# Altium project PCB_Project.PrjPcb
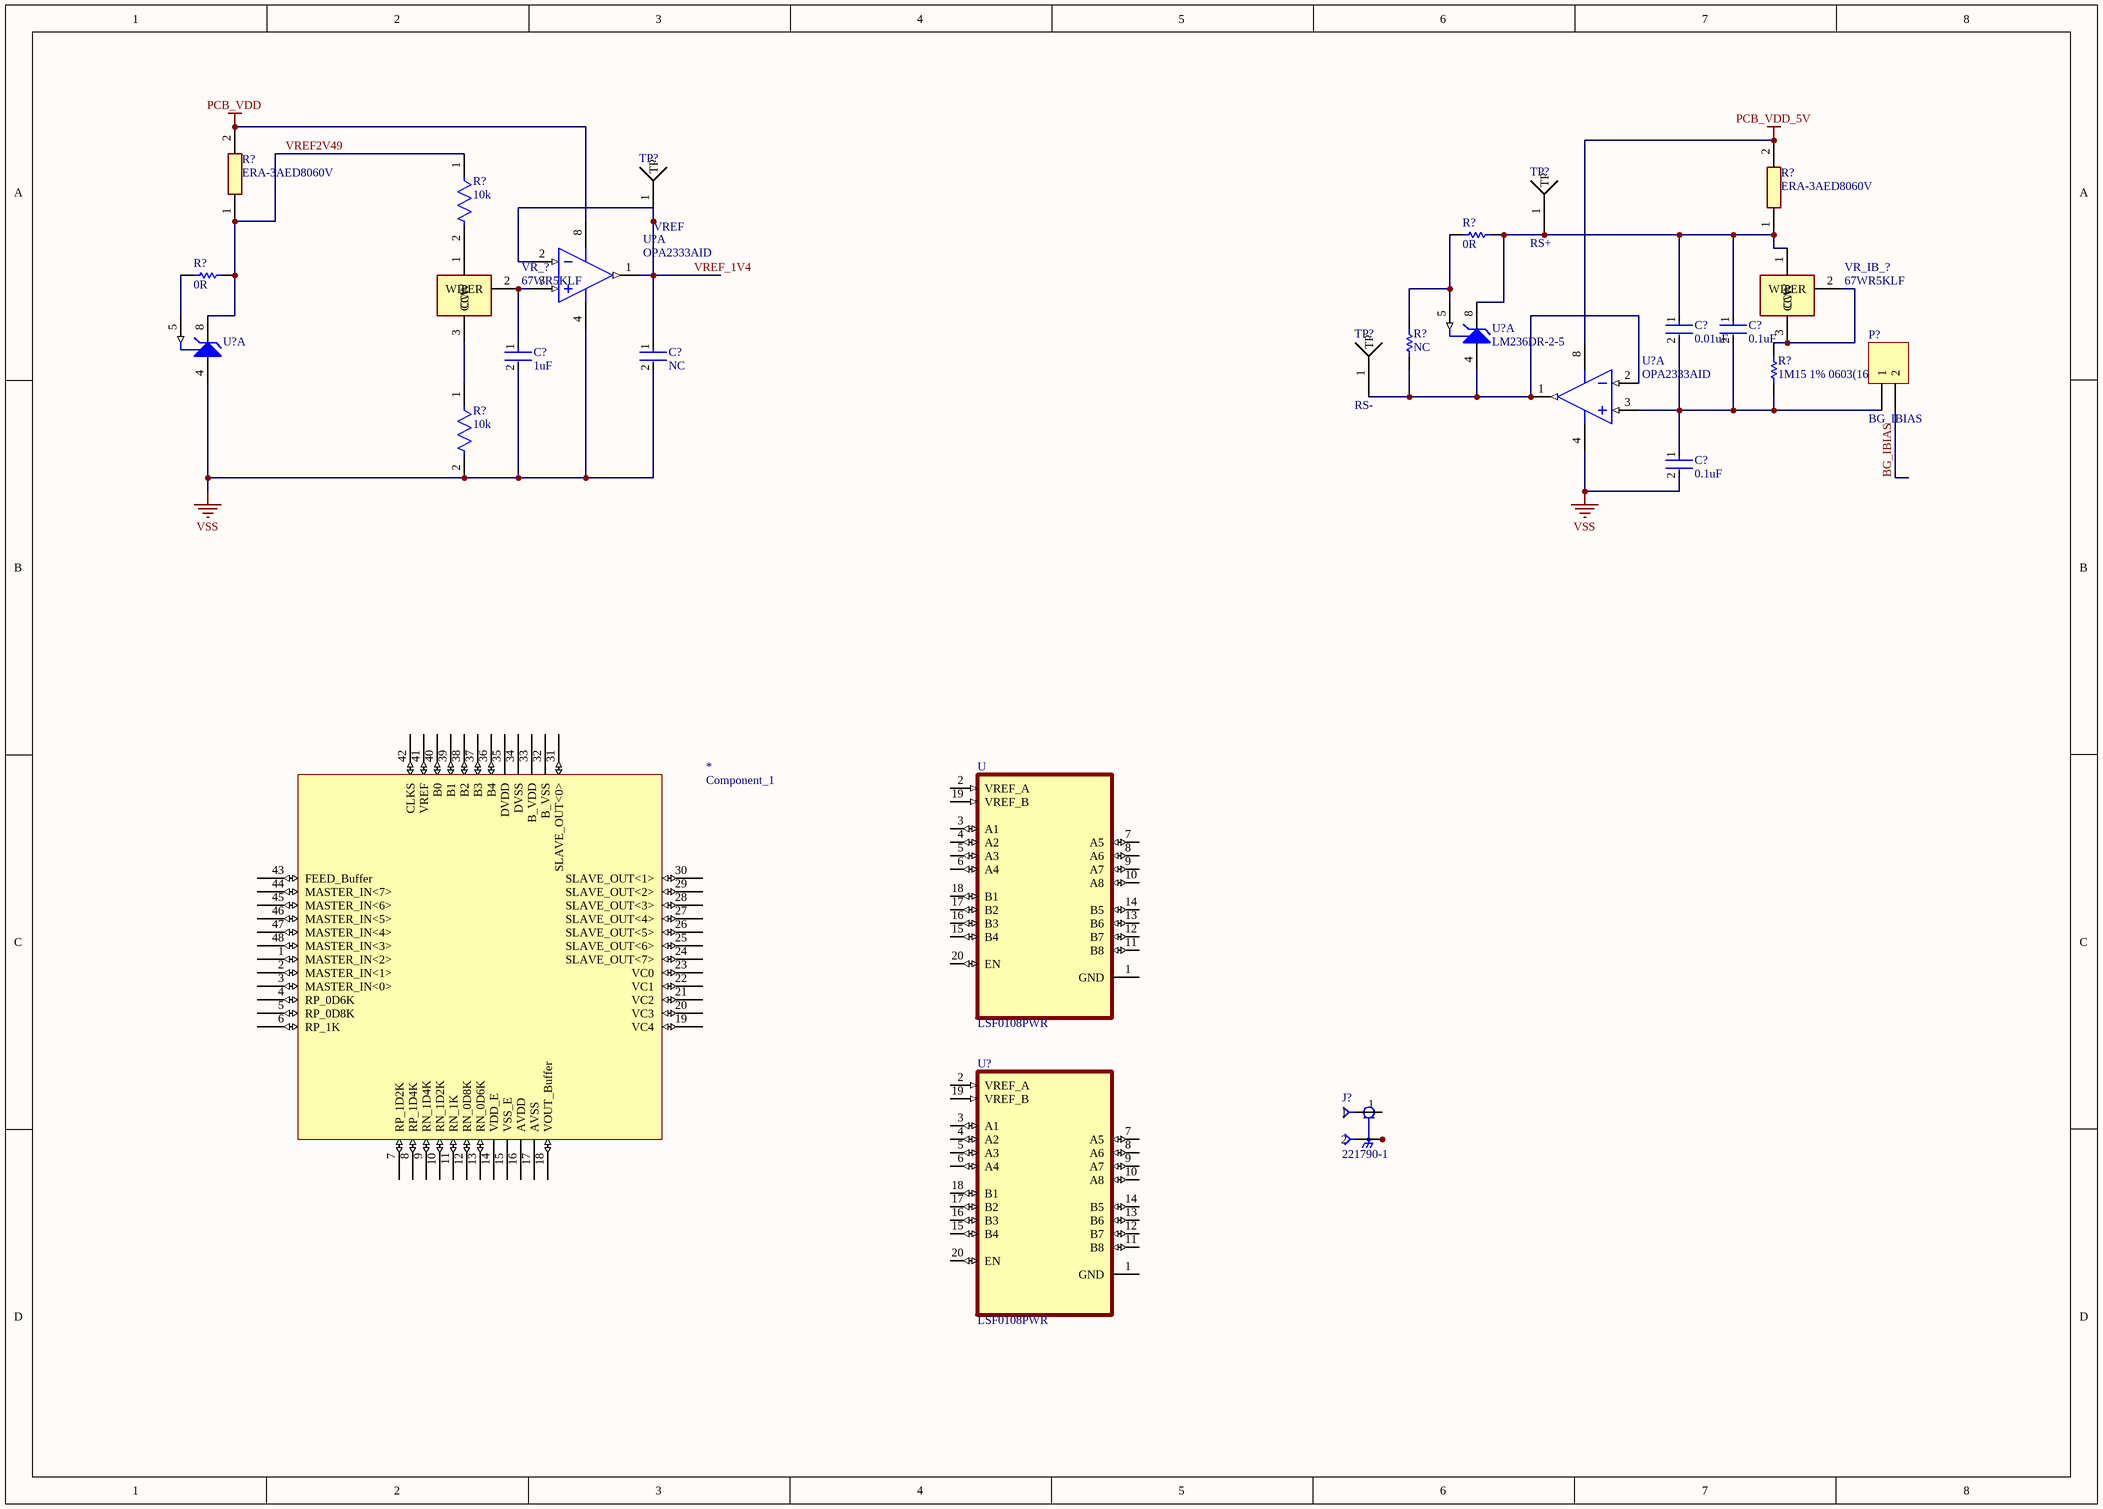
[diagram p0: ADPLL.SchDoc]
1 sheet, 27 parts. Net scope: global (net labels, ports and power ports of the same name join across sheets).

## Sheet ADPLL.SchDoc
size A3; SheetNumber: 1; SheetTotal: 2

### Parts
(Parts that share a designator on the sheet are numbered #1, #2 ... from top to bottom, then left to right.)
*  Component_1  [SB48(DIP48)]
C?#1  0.01uF  [FP-CC0603-DA-MFG]
C?#2  0.1uF  [FP-CC0603-DA-MFG]
C?#3  1uF  [FP-CC0603-DA-MFG]
C?#4  NC  [FP-CC0603-DA-MFG]
C?#5  0.1uF  [FP-CC0603-DA-MFG]
J?  221790-1  [TE_221790-1]
P?  BG_IBIAS  [HDR1X2]
R?#1  10k  [FP-RC0603-0_55-MFG]
R?#2  ERA-3AED8060V  [ERA3AEB101V]
R?#3  0R  [RESC1608X55X25ML10T15]
R?#4  ERA-3AED8060V  [ERA3AEB101V]
R?#5  0R  [RESC1608X55X25ML10T15]
R?#6  NC  [RESC1608X55X25ML10T15]
R?#7  10k  [FP-RC0603-0_55-MFG]
R?#8  1M15 1% 0603(1608)  [RESC0603(1608)_N]
TP?#1  VREF  [TEST_POINT]
TP?#2  RS+  [TEST_POINT]
TP?#3  RS-  [TEST_POINT]
U  LSF0108PWR  [SOP65P640X120-20N]
U?#1  OPA2333AID  [D0008A_L]  (part A of 2)
U?#2  LM236DR-2-5  [D0008A_M]  (part A of 2)
U?#3  (no value)  [D0008A_M]  (part A of 2)
U?#4  OPA2333AID  [D0008A_L]  (part A of 2)
U?#5  LSF0108PWR  [SOP65P640X120-20N]
VR_?  67WR5KLF  [67WR5KLF]
VR_IB_?  67WR5KLF  [67WR5KLF]

### Nets
PCB_VDD: R?#2.2 U?#1.8(V+)
PCB_VDD_5V: R?#4.2 U?#4.8(V+)
VSS: C?#3.2 C?#4.2 C?#5.2 R?#7.2 U?#1.4(V-) U?#3.4(ANODE) U?#4.4(V-)
BG_IBIAS: P?.2
VREF2V49: R?#1.1 R?#2.1 R?#5.2 U?#3.8(CATHODE)
VREF_1V4: C?#4.1 TP?#1.1(TP) U?#1.1(OUT_A) U?#1.2(IN_A-)
NetC?#1_1: C?#1.1 C?#2.1 R?#3.1 R?#4.1 TP?#2.1(TP) U?#2.8(CATHODE) VR_IB_?.1(CCW)
NetC?#1_2: C?#1.2 C?#2.2 C?#5.1 P?.1 R?#8.1 U?#4.3(IN_A+)
NetC?#3_1: C?#3.1 U?#1.3(IN_A+) VR_?.2(WIPER)
NetJ?_2: J?.2 J?.3 J?.4 J?.5
NetR?#1_2: R?#1.2 VR_?.1(CCW)
NetR?#3_2: R?#3.2 R?#6.1 U?#2.5(ADJ)
NetR?#5_1: R?#5.1 U?#3.5(ADJ)
NetR?#6_2: R?#6.2 TP?#3.1(TP) U?#2.4(ANODE) U?#4.1(OUT_A) U?#4.2(IN_A-)
NetR?#7_1: R?#7.1 VR_?.3(CW)
NetR?#8_2: R?#8.2 VR_IB_?.2(WIPER) VR_IB_?.3(CW)

Not connected (* = marked no-connect by the designer): * 1(MASTER_IN<2>) 2(MASTER_IN<1>) 3(MASTER_IN<0>) 4(RP_0D6K) 5(RP_0D8K) 6(RP_1K) 7(RP_1D2K) 8(RP_1D4K) 9(RN_1D4K) 10(RN_1D2K) 11(RN_1K) 12(RN_0D8K) 13(RN_0D6K) 14(VDD_E) 15(VSS_E) 16(AVDD) 17(AVSS) 18(VOUT_Buffer) 19(VC4) 20(VC3) 21(VC2) 22(VC1) 23(VC0) 24(SLAVE_OUT<7>) 25(SLAVE_OUT<6>) 26(SLAVE_OUT<5>) 27(SLAVE_OUT<4>) 28(SLAVE_OUT<3>) 29(SLAVE_OUT<2>) 30(SLAVE_OUT<1>) 31(SLAVE_OUT<0>) 32(B_VSS) 33(B_VDD) 34(DVSS) 35(DVDD) 36(B4) 37(B3) 38(B2) 39(B1) 40(B0) 41(VREF) 42(CLKS) 43(FEED_Buffer) 44(MASTER_IN<7>) 45(MASTER_IN<6>) 46(MASTER_IN<5>) 47(MASTER_IN<4>) 48(MASTER_IN<3>); J? 1; U 1(GND) 2(VREF_A) 3(A1) 4(A2) 5(A3) 6(A4) 7(A5) 8(A6) 9(A7) 10(A8) 11(B8) 12(B7) 13(B6) 14(B5) 15(B4) 16(B3) 17(B2) 18(B1) 19(VREF_B) 20(EN); U?#5 1(GND) 2(VREF_A) 3(A1) 4(A2) 5(A3) 6(A4) 7(A5) 8(A6) 9(A7) 10(A8) 11(B8) 12(B7) 13(B6) 14(B5) 15(B4) 16(B3) 17(B2) 18(B1) 19(VREF_B) 20(EN)

### Library data of the parts
C?#1 = CMP-2100-03600-2: CAP CER 10000PF 50V X7R 0603; Manufacturer Part Number: CC0603KRX7R9BB103; Manufacturer: YAGEO; Tolerance: 0.1; Material: Ceramic; Temperature Coefficient: 15%; Value: 10 nF; Mouser Description: Multilayer Ceramic Capacitor, CC Series, 0.01 - F, - 10%, X7R, 50 V, 0603 [1608 Metric]; Digikey Description: CAP CER 10000PF 50V X7R 0603; Height: 0.9mm; Category: Cap; Temperature Characteristic: X7R; Footprint Url: http://www.yageo.com/exep/pages/download/literatures/UPY-C_GEN_24.pdf; Lead Free: Yes; Voltage Rating: 50 V; Temperature: -55°C to +125°C; Device Class L3: Ceramic Capacitors; ComponentLink2Description: Datasheet; Voltage: 50 V; Package: CC0603-DA; Octopart: https://octopart.com/cc0603krx7r9bb103-yageo-192938; Automotive: No; Temperature Range High: +125°C; Temperature Range Low: -55°C; RoHS: TRUE; Device Class L1: Passive Components; ComponentLink2URL: http://www.yageo.com/documents/recent/UPY-GPHC_X7R_6.3V-to-50V_18.pdf; Device Class L2: Capacitors; Capacitance: 10 nF
C?#2 C?#5 = CMP-2100-03601-2: CAP CER 0.1UF 50V X7R 0603; Manufacturer: YAGEO; Manufacturer Part Number: CC0603KRX7R9BB104; Material: Ceramic; Capacitance: 100 nF; Temperature Coefficient: 15%; Tolerance: 0.1; Value: 100 nF; Height: 0.9mm; Voltage: 50 V; ComponentLink2Description: Datasheet; Device Class L2: Capacitors; Temperature Range High: +125°C; Category: Cap; Footprint Url: http://www.yageo.com/exep/pages/download/literatures/UPY-C_GEN_24.pdf; ComponentLink2URL: http://www.yageo.com/documents/recent/UPY-GPHC_X7R_6.3V-to-50V_18.pdf; Package: CC0603-DA; Temperature: -55°C to +125°C; Voltage Rating: 50 V; Temperature Characteristic: X7R; Device Class L1: Passive Components; Temperature Range Low: -55°C; RoHS: TRUE; Automotive: No; Device Class L3: Ceramic Capacitors; Octopart: https://octopart.com/cc0603krx7r9bb104-yageo-42244635; Mouser Description: Multilayer Ceramic Capacitor, CC Series, 0.1 - F, - 10%, X7R, 50 V, 0603 [1608 Metric]; Lead Free: Yes; Digikey Description: CAP CER 0.1UF 50V X7R 0603
C?#3 C?#4 = CMP-03422-000924-1: CAP CER 1UF 16V X7R 0603; Manufacturer: YAGEO; Manufacturer Part Number: CC0603KRX7R7BB105; Tolerance: 0.1; Temperature Coefficient: 15%; Material: Ceramic; Package: CC0603-DA; RoHS: TRUE; Device Class L2: Capacitors; Temperature Characteristic: X7R; Temperature: -55°C to +125°C; Temperature Range Low: -55°C; Automotive: No; ComponentLink2Description: Datasheet; Value: 1 uF; Lead Free: Yes; Capacitance: 1 uF; ComponentLink2URL: http://www.yageo.com/documents/recent/UPY-GPHC_X7R_6.3V-to-50V_18.pdf; Device Class L1: Passive Components; Voltage: 16 V; Octopart: https://octopart.com/cc0603krx7r7bb105-yageo-42271928; Category: Cap; Digikey Description: CAP CER 1UF 16V X7R 0603; Footprint Url: http://www.yageo.com/exep/pages/download/literatures/UPY-C_GEN_24.pdf; Height: 0.9mm; Voltage Rating: 16 V; Temperature Range High: +125°C; Mouser Description: Multilayer Ceramic Capacitor, CC Series, 1 - F, - 10%, X7R, 16 V, 0603 [1608 Metric]; Device Class L3: Ceramic Capacitors
J? = 221790-1: <b>Connector; SMA; PCB; Right Angle; Stainless Steel; 0.6 in.; Beryllium Copper</b>; Package: None; MP: 221790-1; Value: *; Availability: Unavailable; Price: None
P? = Header 2: Header, 2-Pin; LatestRevisionDate: 17-Jul-2002; LatestRevisionNote: Re-released for DXP Platform.; Publisher: Altium Limited
R?#1 R?#7 = CMP-2100-03664-2: RES 10K OHM 1% 1/10W 0603; Voltage Rating: 75V; Voltage Rating (DC): 50V; Resistance: 10kR; Power Rating: 100mW; Temperature Coefficient: 100ppm/°C; Depth: 0.8mm; Termination: SMD/SMT; Resistor Type: Thick Film; Series: RC; Construction: Rectangular; Features: Moisture Resistant; Packaging: Tape and Reel; Min Operating Temperature: -55°C; Number of Terminations: 2; Lead Pitch: 0.3mm; RoHS Compliant: Yes; Case/Package: 0603; Resistance Tolerance: 1%; Military Standard: Not; Weight: 7.1E-05oz; Number of Pins: 2; Tolerance: 1%; Length: 1.6mm; Case Code (Imperial): 0603; Lead Free: Lead Free; Width: 0.8mm; Max Power Dissipation: 100mW; Height: 0.45mm; Max Operating Temperature: 155°C; Case Code (Metric): 1608; Size Code: 0603
R?#2 R?#4 = ERA-3AED8060V: Resistor; Manufacturer_Name: Panasonic; Datasheet Link: https://industrial.panasonic.com/cdbs/www-data/pdf/RDM0000/AOA0000C307.pdf; Height: 0.55mm; Manufacturer_Part_Number: ERA-3AED8060V; Mouser Part Number: 667-ERA-3AED8060V; Mouser Price/Stock: https://www.mouser.co.uk/ProductDetail/Panasonic/ERA-3AED8060V?qs=MNPzkKEzRtQXSFvTLdZNVA%3D%3D; Arrow Part Number: ERA-3AED8060V; Arrow Price/Stock: https://www.arrow.com/en/products/era-3aed8060v/panasonic
R?#3 R?#5 R?#6 = CMP-2100-03667-1: Chip Resistor, 0 Ohm, +/- 5%, 0.1 W, -55 to 155 degC, 0603 (1608 Metric), RoHS, Tape and Reel; Manufacturer: Yageo; Temperature Coefficient: 200ppm/degreesC; Voltage Rating: 50V; Power Rating: 100mW; Resistance: 0mOhm; Width: 0.8mm; Max Operating Temperature: 155degC; Tolerance: 5%; Package Reference: 0603; Height: 0.45mm; Depth: 0.8mm; Package Description: 2-Pin Surface Mount Device, Body 1.6 x 0.8 mm; Termination: SMD/SMT; Package Quantity: 5000; Case/Package: 0603; Case Code (Imperial): 0603; Radiation Hardening: No; Number of Pins: 2; Length: 1.6mm; Lead Free: LeadFree; Voltage Rating (DC): 50V; Military Standard: Not; Datasheet URL: http://www.yageo.com/NewPortal/yageodocoutput?fileName=/pdf/R-Chip/PYu-RC_Group_51_RoHS_L_5.pdf; Manufacturer URL: http://www.yageo.com/; Packaging: TapeandReel; Case Code (Metric): 1608; Min Operating Temperature: -55degC; Composition: ThickFilm; RoHSCompliant: true; Contact Plating: Tin; Datasheet Version: Rev. 5, 10/2016; REACH SVHC: NoSVHC
R?#8 = CMP-1012-00855-1: 1M15 0.1W 1% 0603 (1608 Metric)  SMD; Value: 1150000.00 Ohm; Case-EIA: 0603; Case-Metric: 1608; Technology: SMT; Power: 0.1 W; Tolerance: 1 %
TP?#1-TP?#3 = TP
U U?#5 = LSF0108PWR: Octal Bidirectional Multi-Voltage-Level Translator 20-TSSOP -40 to 125; MF: Texas Instruments; Texas_Instruments-Purchase-URL: https://snapeda.com/shop?store=Texas+Instruments&id=353489; SnapEDA_Link: https://www.snapeda.com/parts/LSF0108PWR/Texas%20Instruments/view-part/353489/?ref=snap; Value: *; Package: TSSOP-20 Texas Instruments; MP: LSF0108PWR
U?#1 U?#4 = CMP-0272-00776-3: 17 uA, MicroPower, Precision, Zero Drift CMOS Operational Amplifier, 1.8 to 5.5 V, -40 to 125 degC, 8-pin SOIC (D8), Green (RoHS & no Sb/Br); Manufacturer: Texas Instruments; CMRR(Min)(dB): 106; IIB(Max)(pA): 200; Sub Family: Low Offset Voltage Amplifier (<=500uV), Low Power Amp (<=500uA), Low Supply Voltage Amplifier (<=2.7V), Precision Amplifier, Zero Drift Precision Amplifier; Number of Channels: 2; Vio (25C)(Max)(mV): 0.01; Slew Rate(Typ)(V/us): 0.16; Total Supply Voltage(Min)(+5V is 5, +/-5V is 10): 1.8; Total Supply Voltage(Max)(+5V is 5, +/-5V is 10): 5.5; Offset Drift(Typ)(uV/C): 0.02; Iq per channel(Max)(mA): 0.025; ComponentLink3Description: Package Specification; ComponentLink2URL: http://www.ti.com/general/docs/lit/getliterature.tsp?genericPartNumber=OPA2333&fileType=pdf; PackageDescription: 8-Pin Plastic Small Outline, Body 4.9 x 3.9 mm, Pitch 1.27 mm; PackageVersion: 4040047-3/M, 06/2011; Eco-Plan: Green (RoHS & no Sb/Br); ComponentLink1Description: Manufacturer URL; ComponentLink1URL: http://www.ti.com/; ComponentLink2Description: Datasheet; PartNumber: OPA2333AID; Mounting Technology: Surface Mount; DatasheetVersion: SBOS351C; ComponentLink3URL: http://www.ti.com/litv/pdf/msoi002j; PackageReference: D0008A; Code_JEDEC: MS-012
U?#2 = CMP-0366-00496-2: Integrated Reference Circuit, 2.49 V, 13 ppm / degC, 10 mA, -25 to 85 degC, 8-pin SOIC (D), Green (RoHS & no Sb/Br); Manufacturer: Texas Instruments; Iout/Iz(Max)(mA): 10; Initial Accuracy @ 25/deg C(%): 2; Min Iz for Regulation(uA): 400; SubFamily: Shunt Voltage Reference; Temp Coeff(Typ)(ppm/ degree C): 13; Rating: Catalog; VO(V): 2.49; Temp Coeff(Max)(ppm/ degree C): 33; Mounting Technology: Surface Mount; PackageReference: D0008A; ComponentLink1URL: http://www.ti.com/; ComponentLink2URL: http://www.ti.com/general/docs/lit/getliterature.tsp?genericPartNumber=LM236-2.5&fileType=pdf; PackageVersion: 4040047-3/M; PackageDescription: 8-Pin Plastic Small Outline, Body 4.9 x 3.9 mm, Pitch 1.27 mm; ComponentLink2Description: Datasheet; ComponentLink3Description: Package Specification; ComponentLink1Description: Manufacturer URL; ComponentLink3URL: http://www.ti.com/litv/pdf/msoi002j; Eco-Plan: Green (RoHS & no Sb/Br); DatasheetVersion: SLVS063E; PartNumber: LM236DR-2-5; Code_JEDEC: MS-012
U?#3 = CMP-0366-00496-2: Integrated Reference Circuit, 2.49 V, 13 ppm / degC, 10 mA, -25 to 85 degC, 8-pin SOIC (D), Green (RoHS & no Sb/Br); Manufacturer: Texas Instruments; PartNumber: LM236DR-2-5; Iout/Iz(Max)(mA): 10; Initial Accuracy @ 25/deg C(%): 2; Min Iz for Regulation(uA): 400; SubFamily: Shunt Voltage Reference; Temp Coeff(Typ)(ppm/ degree C): 13; Rating: Catalog; VO(V): 2.49; Temp Coeff(Max)(ppm/ degree C): 33; Mounting Technology: Surface Mount; PackageReference: D0008A; ComponentLink1URL: http://www.ti.com/; ComponentLink2URL: http://www.ti.com/general/docs/lit/getliterature.tsp?genericPartNumber=LM236-2.5&fileType=pdf; PackageVersion: 4040047-3/M; PackageDescription: 8-Pin Plastic Small Outline, Body 4.9 x 3.9 mm, Pitch 1.27 mm; ComponentLink2Description: Datasheet; ComponentLink3Description: Package Specification; ComponentLink1Description: Manufacturer URL; ComponentLink3URL: http://www.ti.com/litv/pdf/msoi002j; Eco-Plan: Green (RoHS & no Sb/Br); DatasheetVersion: SLVS063E; Code_JEDEC: MS-012
VR_? = 67WR5KLF: Variable Resistor 5K; Manufacturer_Name: TT Electronics; Datasheet Link: https://datasheet.datasheetarchive.com/originals/distributors/Datasheets-DGA16/937159.pdf; Height: 12.36mm; Manufacturer_Part_Number: 67WR5KLF; Mouser Part Number: 858-67WR5KLF; Mouser Price/Stock: https://www.mouser.co.uk/ProductDetail/BI-Technologies-TT-Electronics/67WR5KLF?qs=gQBTb7UQo2IZpYWbSQGElA%3D%3D; Arrow Part Number: 67WR5KLF; Arrow Price/Stock: https://www.arrow.com/en/products/67wr5klf/bi-technologies?region=europe
VR_IB_? = 67WR5KLF: Variable Resistor 10K; Manufacturer_Name: TT Electronics; Datasheet Link: https://datasheet.datasheetarchive.com/originals/distributors/Datasheets-DGA16/937159.pdf; Height: 12.36mm; Manufacturer_Part_Number: 67WR5KLF; Mouser Part Number: 858-67WR5KLF; Mouser Price/Stock: https://www.mouser.co.uk/ProductDetail/BI-Technologies-TT-Electronics/67WR5KLF?qs=gQBTb7UQo2IZpYWbSQGElA%3D%3D; Arrow Part Number: 67WR5KLF; Arrow Price/Stock: https://www.arrow.com/en/products/67wr5klf/bi-technologies?region=europe